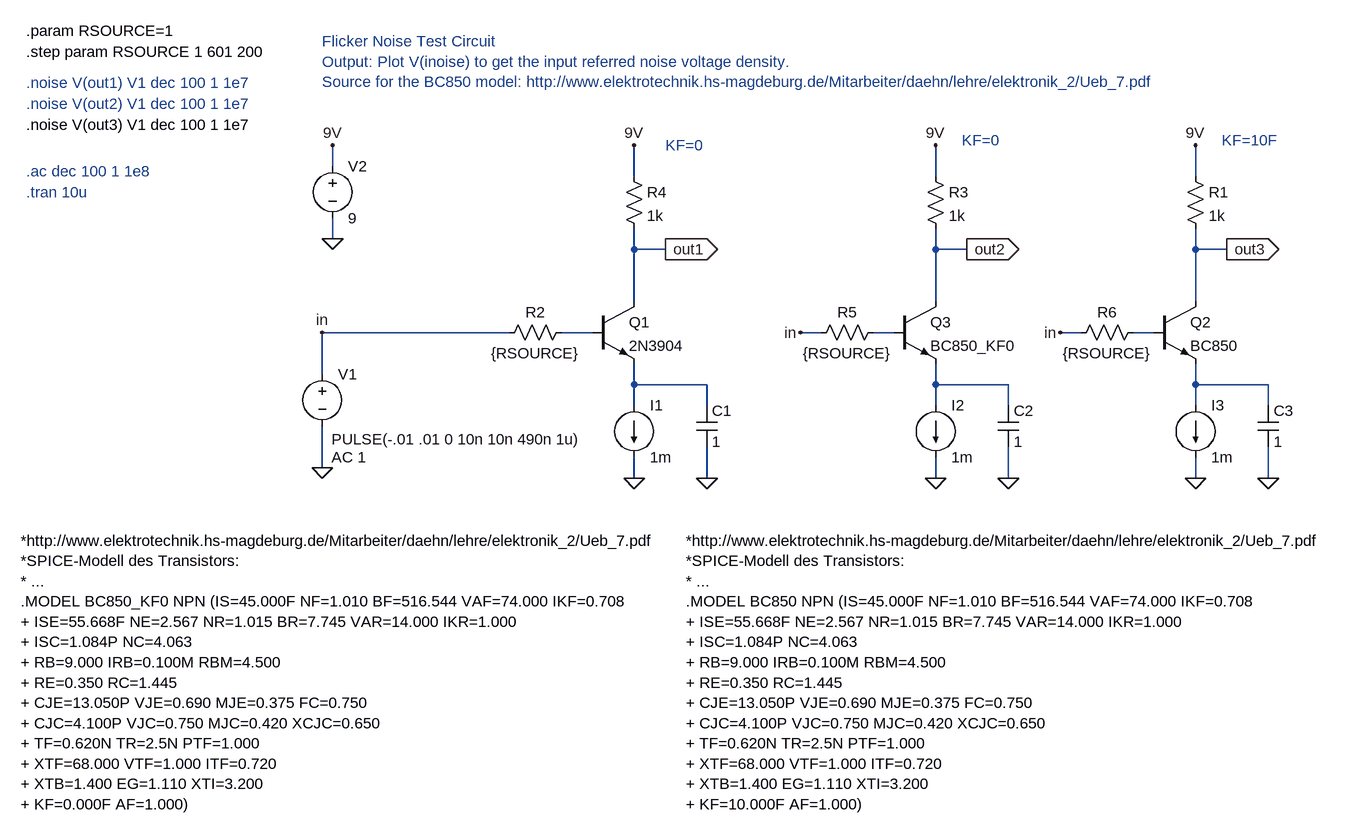
[diagram p0: schematic flicker_noise_2N3904_BC850.asc]
flicker_noise_2N3904_BC850.asc, the LTspice schematic file:
Version 4
SHEET 1 1748 1212
WIRE -128 176 -128 112
WIRE -128 320 -128 256
WIRE -112 -144 -112 -176
WIRE -112 -32 -112 -64
WIRE 160 112 -128 112
WIRE 288 112 240 112
WIRE 352 -128 352 -176
WIRE 352 -16 352 -48
WIRE 352 64 352 -16
WIRE 352 192 352 160
WIRE 352 224 352 192
WIRE 352 336 352 304
WIRE 400 -16 352 -16
WIRE 464 192 352 192
WIRE 464 224 464 192
WIRE 464 336 464 288
WIRE 640 112 608 112
WIRE 752 112 720 112
WIRE 816 -128 816 -176
WIRE 816 -16 816 -48
WIRE 816 64 816 -16
WIRE 816 192 816 160
WIRE 816 224 816 192
WIRE 816 336 816 304
WIRE 864 -16 816 -16
WIRE 928 192 816 192
WIRE 928 224 928 192
WIRE 928 336 928 288
WIRE 1040 112 1008 112
WIRE 1152 112 1120 112
WIRE 1216 -128 1216 -176
WIRE 1216 -16 1216 -48
WIRE 1216 64 1216 -16
WIRE 1216 192 1216 160
WIRE 1216 224 1216 192
WIRE 1216 336 1216 304
WIRE 1264 -16 1216 -16
WIRE 1328 192 1216 192
WIRE 1328 224 1328 192
WIRE 1328 336 1328 288
FLAG -128 320 0
FLAG -128 112 in
FLAG 608 112 in
FLAG 352 -176 9V
FLAG 816 -176 9V
FLAG -112 -176 9V
FLAG -112 -32 0
FLAG 864 -16 out2
IOPIN 864 -16 Out
FLAG 400 -16 out1
IOPIN 400 -16 Out
FLAG 816 336 0
FLAG 352 336 0
FLAG 928 336 0
FLAG 464 336 0
FLAG 1008 112 in
FLAG 1216 -176 9V
FLAG 1264 -16 out3
IOPIN 1264 -16 Out
FLAG 1216 336 0
FLAG 1328 336 0
SYMBOL npn 288 64 R0
SYMATTR InstName Q1
SYMATTR Value 2N3904
SYMBOL res 800 -144 R0
SYMATTR InstName R3
SYMATTR Value 1k
SYMBOL res 336 -144 R0
SYMATTR InstName R4
SYMATTR Value 1k
SYMBOL voltage -128 160 R0
WINDOW 3 14 116 Left 0
WINDOW 123 14 144 Left 0
WINDOW 39 24 132 Left 0
SYMATTR InstName V1
SYMATTR Value PULSE(-.01 .01 0 10n 10n 490n 1u)
SYMATTR Value2 AC 1
SYMBOL voltage -112 -160 R0
SYMATTR InstName V2
SYMATTR Value 9
SYMBOL current 352 224 R0
SYMATTR InstName I1
SYMATTR Value 1m
SYMBOL current 816 224 R0
SYMATTR InstName I2
SYMATTR Value 1m
SYMBOL cap 448 224 R0
SYMATTR InstName C1
SYMATTR Value 1
SYMBOL cap 912 224 R0
SYMATTR InstName C2
SYMATTR Value 1
SYMBOL res 1200 -144 R0
SYMATTR InstName R1
SYMATTR Value 1k
SYMBOL current 1216 224 R0
SYMATTR InstName I3
SYMATTR Value 1m
SYMBOL cap 1312 224 R0
SYMATTR InstName C3
SYMATTR Value 1
SYMBOL npn 1152 64 R0
SYMATTR InstName Q2
SYMATTR Value BC850
SYMBOL npn 752 64 R0
SYMATTR InstName Q3
SYMATTR Value BC850_KF0
SYMBOL res 144 128 R270
WINDOW 0 32 56 VTop 0
WINDOW 3 0 56 VBottom 0
SYMATTR InstName R2
SYMATTR Value {RSOURCE}
SYMBOL res 624 128 R270
WINDOW 0 32 56 VTop 0
WINDOW 3 0 56 VBottom 0
SYMATTR InstName R5
SYMATTR Value {RSOURCE}
SYMBOL res 1024 128 R270
WINDOW 0 32 56 VTop 0
WINDOW 3 0 56 VBottom 0
SYMATTR InstName R6
SYMATTR Value {RSOURCE}
TEXT 432 432 Left 0 !*http://www.elektrotechnik.hs-magdeburg.de/Mitarbeiter/daehn/lehre/elektronik_2/Ueb_7.pdf\n*SPICE-Modell des Transistors:\n* ...\n.MODEL BC850 NPN (IS=45.000F NF=1.010 BF=516.544 VAF=74.000 IKF=0.708\n+ ISE=55.668F NE=2.567 NR=1.015 BR=7.745 VAR=14.000 IKR=1.000\n+ ISC=1.084P NC=4.063\n+ RB=9.000 IRB=0.100M RBM=4.500\n+ RE=0.350 RC=1.445\n+ CJE=13.050P VJE=0.690 MJE=0.375 FC=0.750\n+ CJC=4.100P VJC=0.750 MJC=0.420 XCJC=0.650\n+ TF=0.620N TR=2.5N PTF=1.000\n+ XTF=68.000 VTF=1.000 ITF=0.720\n+ XTB=1.400 EG=1.110 XTI=3.200\n+ KF=10.000F AF=1.000)
TEXT -584 -104 Left 0 ;.tran 10u
TEXT -584 -136 Left 0 ;.ac dec 100 1 1e8
TEXT -584 -272 Left 0 ;.noise V(out1) V1 dec 100 1 1e7
TEXT -584 -240 Left 0 ;.noise V(out2) V1 dec 100 1 1e7
TEXT -592 432 Left 0 !*http://www.elektrotechnik.hs-magdeburg.de/Mitarbeiter/daehn/lehre/elektronik_2/Ueb_7.pdf\n*SPICE-Modell des Transistors:\n* ...\n.MODEL BC850_KF0 NPN (IS=45.000F NF=1.010 BF=516.544 VAF=74.000 IKF=0.708\n+ ISE=55.668F NE=2.567 NR=1.015 BR=7.745 VAR=14.000 IKR=1.000\n+ ISC=1.084P NC=4.063\n+ RB=9.000 IRB=0.100M RBM=4.500\n+ RE=0.350 RC=1.445\n+ CJE=13.050P VJE=0.690 MJE=0.375 FC=0.750\n+ CJC=4.100P VJC=0.750 MJC=0.420 XCJC=0.650\n+ TF=0.620N TR=2.5N PTF=1.000\n+ XTF=68.000 VTF=1.000 ITF=0.720\n+ XTB=1.400 EG=1.110 XTI=3.200\n+ KF=0.000F AF=1.000)
TEXT 856 -184 Left 0 ;KF=0
TEXT -584 -208 Left 0 !.noise V(out3) V1 dec 100 1 1e7
TEXT 1256 -184 Left 0 ;KF=10F
TEXT 400 -176 Left 0 ;KF=0
TEXT -128 -336 Left 0 ;Flicker Noise Test Circuit\nOutput: Plot V(inoise) to get the input referred noise voltage density.\nSource for the BC850 model: http://www.elektrotechnik.hs-magdeburg.de/Mitarbeiter/daehn/lehre/elektronik_2/Ueb_7.pdf
TEXT -584 -352 Left 0 !.param RSOURCE=1
TEXT -584 -320 Left 0 !.step param RSOURCE 1 601 200

The netlist it stands for:
* flicker_noise_2N3904_BC850.asc
Q1 out1 N001 N002 0 2N3904
R3 9V out2 1k
R4 9V out1 1k
V1 in 0 PULSE(-.01 .01 0 10n 10n 490n 1u) AC 1
V2 9V 0 9
I1 N002 0 1m
I2 N004 0 1m
C1 N002 0 1
C2 N004 0 1
R1 9V out3 1k
I3 N006 0 1m
C3 N006 0 1
Q2 out3 N005 N006 0 BC850
Q3 out2 N003 N004 0 BC850_KF0
R2 in N001 {RSOURCE}
R5 in N003 {RSOURCE}
R6 in N005 {RSOURCE}
.model NPN NPN
.model PNP PNP
.lib standard.bjt
*http://www.elektrotechnik.hs-magdeburg.de/Mitarbeiter/daehn/lehre/elektronik_2/Ueb_7.pdf
*SPICE-Modell des Transistors:
* ...
.MODEL BC850 NPN (IS=45.000F NF=1.010 BF=516.544 VAF=74.000 IKF=0.708
+ ISE=55.668F NE=2.567 NR=1.015 BR=7.745 VAR=14.000 IKR=1.000
+ ISC=1.084P NC=4.063
+ RB=9.000 IRB=0.100M RBM=4.500
+ RE=0.350 RC=1.445
+ CJE=13.050P VJE=0.690 MJE=0.375 FC=0.750
+ CJC=4.100P VJC=0.750 MJC=0.420 XCJC=0.650
+ TF=0.620N TR=2.5N PTF=1.000
+ XTF=68.000 VTF=1.000 ITF=0.720
+ XTB=1.400 EG=1.110 XTI=3.200
+ KF=10.000F AF=1.000)
* .tran 10u
* .ac dec 100 1 1e8
* .noise V(out1) V1 dec 100 1 1e7
* .noise V(out2) V1 dec 100 1 1e7
*http://www.elektrotechnik.hs-magdeburg.de/Mitarbeiter/daehn/lehre/elektronik_2/Ueb_7.pdf
*SPICE-Modell des Transistors:
* ...
.MODEL BC850_KF0 NPN (IS=45.000F NF=1.010 BF=516.544 VAF=74.000 IKF=0.708
+ ISE=55.668F NE=2.567 NR=1.015 BR=7.745 VAR=14.000 IKR=1.000
+ ISC=1.084P NC=4.063
+ RB=9.000 IRB=0.100M RBM=4.500
+ RE=0.350 RC=1.445
+ CJE=13.050P VJE=0.690 MJE=0.375 FC=0.750
+ CJC=4.100P VJC=0.750 MJC=0.420 XCJC=0.650
+ TF=0.620N TR=2.5N PTF=1.000
+ XTF=68.000 VTF=1.000 ITF=0.720
+ XTB=1.400 EG=1.110 XTI=3.200
+ KF=0.000F AF=1.000)
* KF=0
.noise V(out3) V1 dec 100 1 1e7
* KF=10F
* KF=0
* Flicker Noise Test Circuit
* Output: Plot V(inoise) to get the input referred noise voltage density.
* Source for the BC850 model: http://www.elektrotechnik.hs-magdeburg.de/Mitarbeiter/daehn/lehre/elektronik_2/Ueb_7.pdf
.param RSOURCE=1
.step param RSOURCE 1 601 200
.backanno
.end